# EAGLE design EX-YU_16K_C64_CART (EAGLE 6.3)
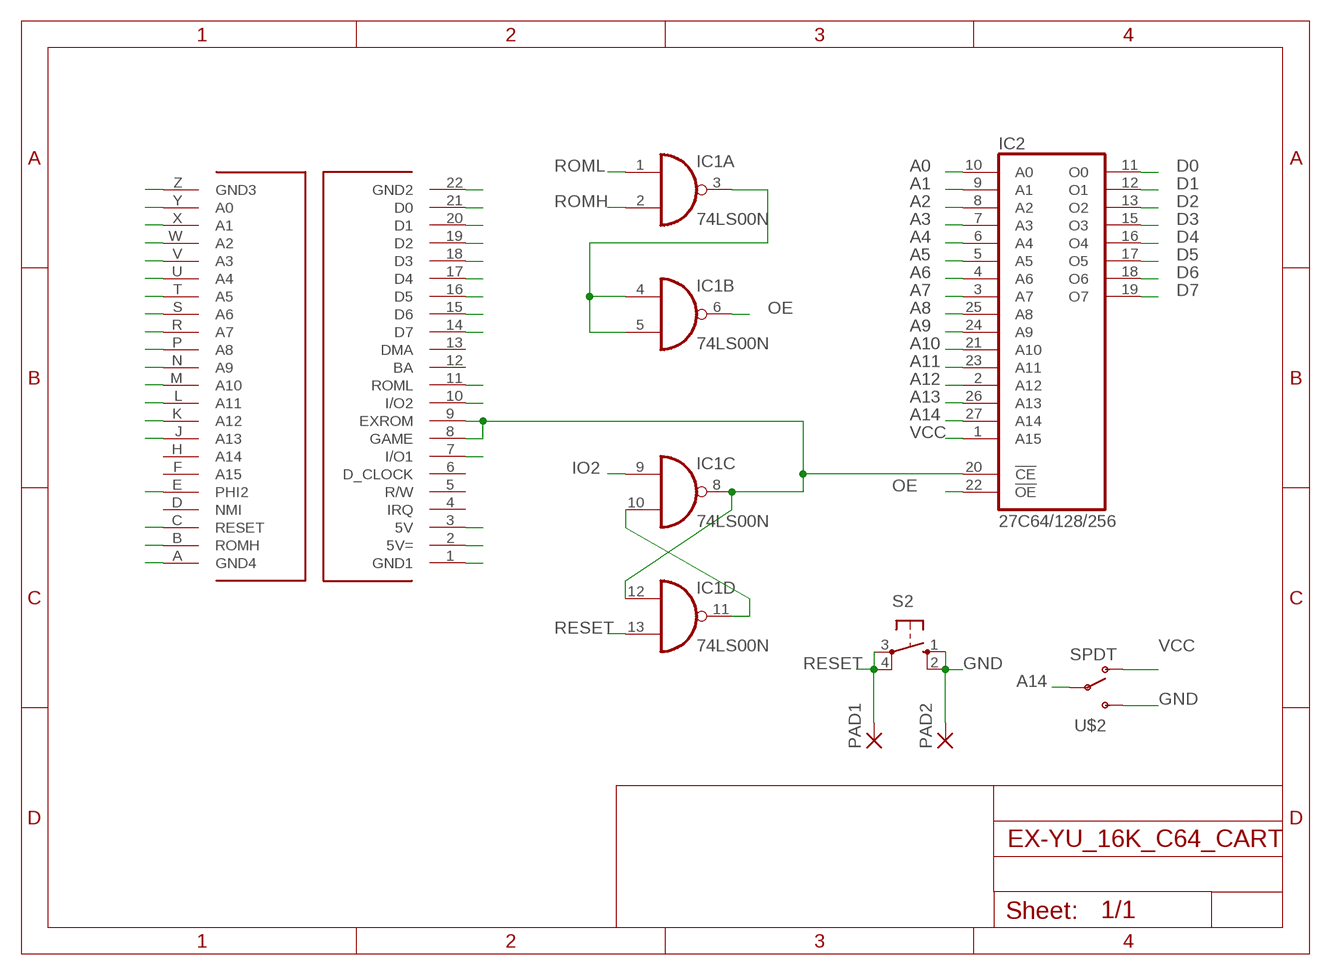
[diagram p0: schematic, sheet 1]

## Parts
IC1  74LS00N  [DIL14]
IC2  27C64/128/256  27512  [DIL28]
PAD1  SMD5  [SMD2,54-5,08]
PAD2  SMD5  [SMD2,54-5,08]
S2  10-XX  [B3F-10XX]
U$1  C64_EXPANSION__CARTRIDGE  [C64_EXPANSION__CARTRIDGE]
U$2  SPDT  [SPDT-SLIDE]

## Nets
A0: IC2.10(A0) U$1.Y(A0)
A1: IC2.9(A1) U$1.X(A1)
A2: IC2.8(A2) U$1.W(A2)
A3: IC2.7(A3) U$1.V(A3)
A4: IC2.6(A4) U$1.U(A4)
A5: IC2.5(A5) U$1.T(A5)
A6: IC2.4(A6) U$1.S(A6)
A7: IC2.3(A7) U$1.R(A7)
A8: IC2.25(A8) U$1.P(A8)
A9: IC2.24(A9) U$1.N(A9)
A10: IC2.21(A10) U$1.M(A10)
A11: IC2.23(A11) U$1.L(A11)
A12: IC2.2(A12) U$1.K(A12)
A13: IC2.26(A13) U$1.J(A13)
A14: IC2.27(A14) U$2.2
D0: IC2.11(O0) U$1.21(D0)
D1: IC2.12(O1) U$1.20(D1)
D2: IC2.13(O2) U$1.19(D2)
D3: IC2.15(O3) U$1.18(D3)
D4: IC2.16(O4) U$1.17(D4)
D5: IC2.17(O5) U$1.16(D5)
D6: IC2.18(O6) U$1.15(D6)
D7: IC2.19(O7) U$1.14(D7)
GND: PAD2.1(P) S2.1(S) S2.2(S1) U$1.1(GND1) U$1.22(GND2) U$1.A(GND4) U$1.Z(GND3) U$2.3
IO1: U$1.7(I/O1)
IO2: IC1.9(C:I0) U$1.10(I/O2)
N$3: IC1.3(A:O) IC1.4(B:I0) IC1.5(B:I1)
N$5: IC1.10(C:I1) IC1.11(D:O)
N$6: IC1.8(C:O) IC1.12(D:I0) IC2.20(!CE) U$1.8(GAME) U$1.9(EXROM)
OE: IC1.6(B:O) IC2.22(!OE)
PHI2: U$1.E(PHI2)
RESET: IC1.13(D:I1) PAD1.1(P) S2.3(P) S2.4(P1) U$1.C(RESET)
ROMH: IC1.2(A:I1) U$1.B(ROMH)
ROML: IC1.1(A:I0) U$1.11(ROML)
VCC: IC2.1(A15) U$1.2(5V=) U$1.3(5V) U$2.1
Unconnected: U$1.4(IRQ) U$1.5(R/W) U$1.6(D_CLOCK) U$1.12(BA) U$1.13(DMA) U$1.D(NMI) U$1.F(A15) U$1.H(A14)

## Power pins joined to a net without a drawn wire
GND: IC1.7(P:GND) IC2.14(GND)
VCC: IC1.14(P:VCC) IC2.28(VCC)

## Library data of the parts
IC1 = 74xx-eu:74*00: Quad 2-input NAND gate
IC2 = memory:27512: MEMORY
PAD1 PAD2 = wirepad:SMD5: SMD PAD
S2 = switch-omron:10-XX: OMRON SWITCH; MPN: B3F-1000; OC_FARNELL: 176432; OC_NEWARK: 36M3542
U$1 = 64kb_cart-slim:C64_EXPANSION__CARTRIDGE
U$2 = switches:SPDT

## Board
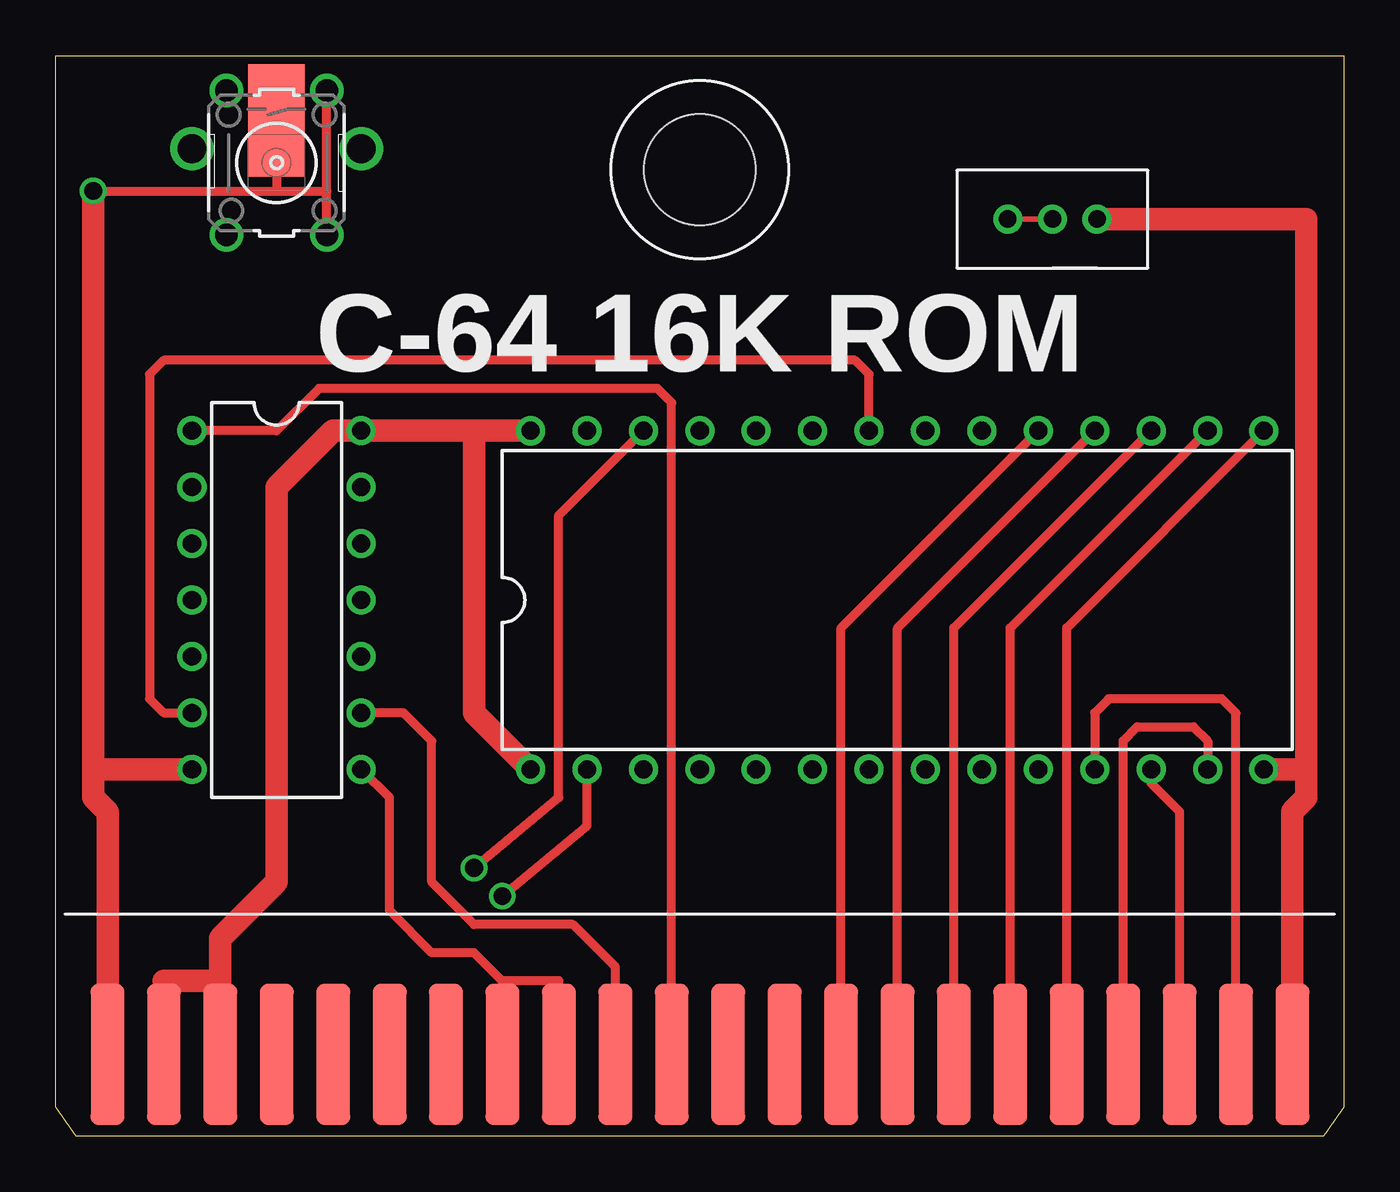
[diagram p1: board, top side]
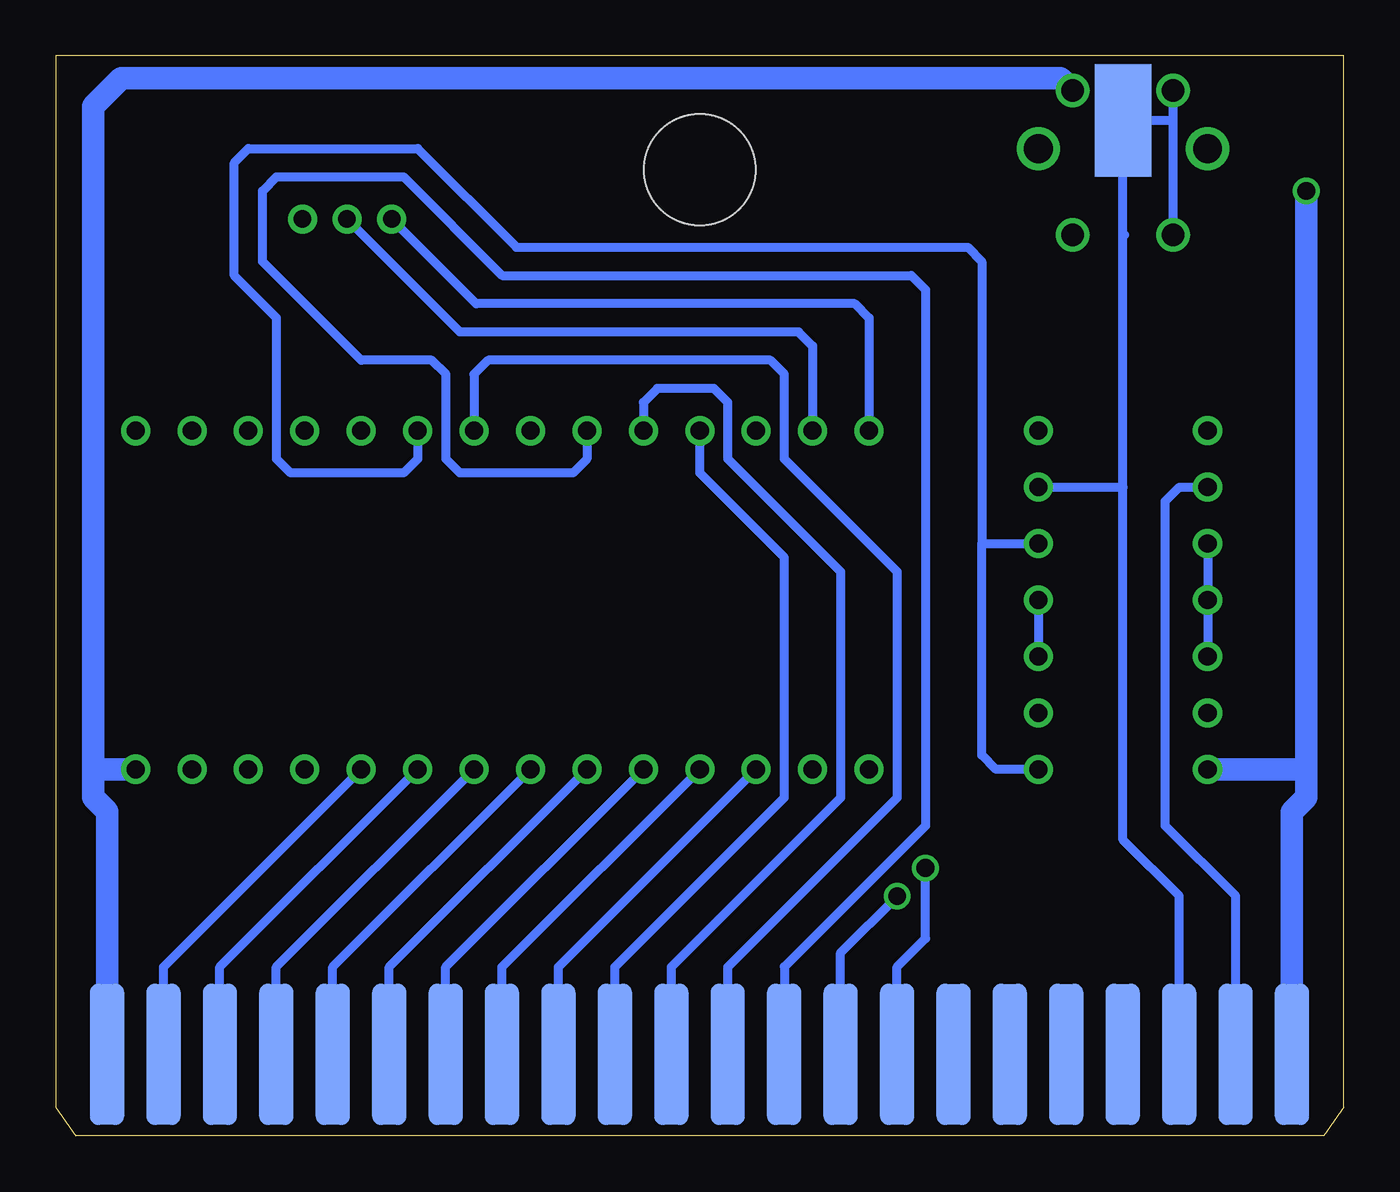
[diagram p2: board, bottom side, seen from below]

Size 58 x 48.63 mm. Coordinates in mm from the lower left corner, seen from the top.
Copper layers (1*16): Top 0.035mm / dielectric 1.5mm / Bottom 0.035mm
Design rules "dirt_cheap_dirty_boards.v1 *": minimum track width 5mil, minimum drill 12mil, track to track 5mil, track to pad 5mil, pad to pad 5mil, via to via 5mil, smd to smd 0mil, copper to edge 10mil, drill to drill 10mil, minimum pad ring 10mil, minimum via ring 6mil, stop-mask expansion 2mil, vias tented up to drill 25mil, thermal gap 10mil

### Footprints (pad centres in the part's own frame; a part is rotated, then mirrored left to right if it is on the bottom)
DIL14 = drill 0.813 long: 1 -7.62,-3.81; 2 -5.08,-3.81; 3 -2.54,-3.81; 4 0,-3.81; 5 2.54,-3.81; 6 5.08,-3.81; 7 7.62,-3.81; 8 7.62,3.81; 9 5.08,3.81; 10 2.54,3.81; 11 0,3.81; 12 -2.54,3.81; 13 -5.08,3.81; 14 -7.62,3.81
DIL28 = drill 0.813 long: 1 -16.51,-7.62; 2 -13.97,-7.62; 3 -11.43,-7.62; 4 -8.89,-7.62; 5 -6.35,-7.62; 6 -3.81,-7.62; 7 -1.27,-7.62; 8 1.27,-7.62; 9 3.81,-7.62; 10 6.35,-7.62; 11 8.89,-7.62; 12 11.43,-7.62; 13 13.97,-7.62; 14 16.51,-7.62; 15 16.51,7.62; 16 13.97,7.62; 17 11.43,7.62; 18 8.89,7.62; 19 6.35,7.62; 20 3.81,7.62; 21 1.27,7.62; 22 -1.27,7.62; 23 -3.81,7.62; 24 -6.35,7.62; 25 -8.89,7.62; 26 -11.43,7.62; 27 -13.97,7.62; 28 -16.51,7.62
SMD2,54-5,08 = smd 2.54 x 5.08: 1 0,0
B3F-10XX = drill 1.016 long: 1 -3.251,2.261; 2 3.251,2.261; 3 -3.251,-2.261; 4 3.251,-2.261
C64_EXPANSION__CARTRIDGE = smd 1.524 x 6.35: 1 5.09,3.675; 2 7.63,3.675; 3 10.17,3.675; 4 12.71,3.675; 5 15.25,3.675; 6 17.79,3.675; 7 20.33,3.675; 8 22.87,3.675; 9 25.41,3.675; 10 27.95,3.675; 11 30.49,3.675; 12 33.03,3.675; 13 35.57,3.675; 14 38.11,3.675; 15 40.65,3.675; 16 43.19,3.675; 17 45.73,3.675; 18 48.27,3.675; 19 50.81,3.675; 20 53.35,3.675; 21 55.89,3.675; 22 58.43,3.675 | smd 1.524 x 6.35 bottom: A 5.09,3.675; B 7.63,3.675; C 10.17,3.675; D 12.71,3.675; E 15.25,3.675; F 17.79,3.675; H 20.33,3.675; J 22.87,3.675; K 25.41,3.675; L 27.95,3.675; M 30.49,3.675; N 33.03,3.675; P 35.57,3.675; R 38.11,3.675; S 40.65,3.675; T 43.19,3.675; U 45.73,3.675; V 48.27,3.675; W 50.81,3.675; X 53.35,3.675; Y 55.89,3.675; Z 58.43,3.675 | hole 5: 31.75,43.5
SPDT-SLIDE = drill 0.787: 1 -2.007,0; 2 0,0; 3 2.007,0

### Placement (x,y rotation side)
IC1  9.95,24.13 270 top
IC2  37.89,24.13 0 top
PAD1  9.95,45.72 0 bottom
PAD2  9.95,45.72 0 top
S2  9.95,43.82 270 top
U$1  -2.75,0 0 top
U$2  44.88,41.27 0 top

### Tracks (layer width: path | path; a pad name or v marks a point on that pad's centre or on a via)
A0
  Bottom 0.406: U$1.Y 53.14,7.61 IC2.10
A1
  Bottom 0.406: U$1.X 50.6,7.61 IC2.9
A2
  Bottom 0.406: U$1.W 48.06,7.61 IC2.8
A3
  Bottom 0.406: U$1.V 45.52,7.61 IC2.7
A4
  Bottom 0.406: U$1.U 42.98,7.61 IC2.6
A5
  Bottom 0.406: U$1.T 40.44,7.61 IC2.5
A6
  Bottom 0.406: U$1.S 37.9,7.61 IC2.4
A7
  Bottom 0.406: U$1.R 35.36,7.61 IC2.3
A8
  Bottom 0.406: U$1.P 32.82,7.61 25.19,15.24 25.19,26.04 29,29.84 IC2.25
A9
  Bottom 0.406: U$1.N 30.28,7.61 22.65,15.24 22.65,25.4 27.73,30.48 27.73,33.02 28.36,33.66 30.9,33.66 31.54,33.02 IC2.24
A10
  Bottom 0.406: U$1.M 27.74,7.61 20.11,15.24 20.11,25.4 25.19,30.48 25.19,34.29 25.82,34.93 38.52,34.93 39.16,34.29 IC2.21
A11
  Bottom 0.406: IC2.23 34.08,30.48 34.71,29.84 39.8,29.84 40.43,30.48 40.43,34.29 41.06,34.93 44.24,34.93 48.69,39.37 48.69,42.55 48.05,43.18 42.34,43.18 37.89,38.73 19.47,38.73 18.84,38.1 18.84,13.97 25.19,7.62 U$1.L
A12  (via drill 0.8)
  Top 0.406: v20.11,10.79 23.92,13.97 IC2.2
  Bottom 0.406: U$1.K 22.66,8.25 v20.11,10.79
A13  (via drill 0.8)
  Top 0.406: v18.84,12.06 22.65,15.24 22.65,27.94 IC2.26
  Bottom 0.406: U$1.J 20.12,7.61 18.84,8.89 v18.84,12.06
A14
  Bottom 0.406: IC2.27 23.92,35.56 24.55,36.2 39.8,36.2 U$2.2
D0
  Top 0.406: U$1.21 53.14,19.04 52.49,19.68 47.41,19.68 46.78,19.05 IC2.11
D1
  Top 0.406: U$1.20 50.6,14.6 49.32,15.88 IC2.12
D2
  Top 0.406: U$1.19 48.06,17.79 48.69,18.41 51.23,18.41 51.86,17.78 IC2.13
D3
  Top 0.406: U$1.18 45.52,22.87 IC2.15
D4
  Top 0.406: U$1.17 42.98,22.87 IC2.16
D5
  Top 0.406: U$1.16 40.44,22.87 IC2.17
D6
  Top 0.406: U$1.15 37.9,22.87 IC2.18
D7
  Top 0.406: U$1.14 35.36,22.87 IC2.19
GND  (via drill 0.8)
  Top 0.406: S2.2 12.21,42.55 | 12.21,42.55 S2.1 | v1.7,42.55 9.95,42.55 | 9.95,42.55 12.21,42.55 | PAD2.1 9.95,42.55
  Top 1.016: U$1.Z 55.68,14.62 56.3,15.24 56.3,16.51 | IC2.14 56.3,16.51 | U$1.A 2.34,14.6 1.7,15.24 1.7,16.51 | 1.7,16.51 v1.7,42.55 | IC1.7 1.7,16.51 | U$2.3 56.3,41.27 56.3,16.51
  Bottom 1.016: 56.3,16.51 56.3,15.24 55.68,14.62 U$1.Z | U$1.A 2.34,14.6 1.7,15.24 1.7,16.51 | 1.7,16.51 v1.7,42.55 | IC1.7 1.7,16.51 | IC2.14 56.3,16.51 | 56.3,16.51 56.3,46.36 55.03,47.62 12.77,47.62 S2.1
IO2
  Top 0.406: U$1.10 25.2,7.61 23.29,9.53 18.84,9.53 16.93,11.43 16.93,17.78 15.66,19.05 IC1.9
N$1  (via drill 1.3)
  other vias: 6.14,44.45
N$2  (via drill 1.3)
  other vias: 13.76,44.45
N$3
  Bottom 0.406: IC1.3 IC1.4 IC1.5
N$4
  Top 0.254: 42.97,41.27 44.88,41.27
N$5
  Bottom 0.406: IC1.11 IC1.10
N$6
  Top 0.406: U$1.9 22.66,6.98 22.65,6.99 20.11,6.99 | 20.11,6.99 U$1.8 | 20.11,6.99 18.84,8.26 16.93,8.26 15.03,10.16 15.03,15.24 IC1.8
  Bottom 0.406: IC2.20 41.7,30.48 42.34,29.84 47.41,29.84 48.05,30.48 48.05,36.83 49.95,38.73 49.95,43.82 49.32,44.45 41.7,44.45 37.26,40.01 16.93,40.01 16.3,39.37 16.3,26.67 | IC1.8 15.66,16.51 16.3,17.14 16.3,26.67 | 16.3,26.67 IC1.12
OE
  Top 0.406: IC2.22 36.62,34.29 35.98,34.93 4.87,34.93 4.24,34.29 4.24,19.68 4.87,19.05 IC1.6
RESET
  Bottom 0.406: U$1.C 7.42,10.8 9.95,13.34 9.95,29.21 | IC1.13 9.95,29.21 | 9.95,29.21 9.95,40.64 | 9.95,40.64 PAD1.1 7.69,45.72 | 9.87,40.56 9.95,40.64 | S2.4 7.69,45.72 | 7.69,45.72 S2.3
ROMH
  Bottom 0.406: U$1.B 4.88,10.8 8.05,13.97 8.05,28.57 7.41,29.21 IC1.2
ROML
  Top 0.406: U$1.11 27.74,33.01 27.09,33.66 11.86,33.66 9.95,31.75 IC1.1
VCC
  Top 1.016: U$1.3 7.42,6.99 | 7.42,6.99 7.42,8.9 9.95,11.43 9.95,29.21 12.49,31.75 IC1.14 18.84,31.75 | 18.84,31.75 IC2.28 | IC2.1 18.84,19.05 18.84,31.75 | U$1.2 4.88,6.98 4.87,6.99 7.42,6.99
  Bottom 0.406: IC2.28 21.38,36.83 22.02,37.47 39.06,37.47 U$2.1

### Text on the board
tNames: C-64 16K ROM